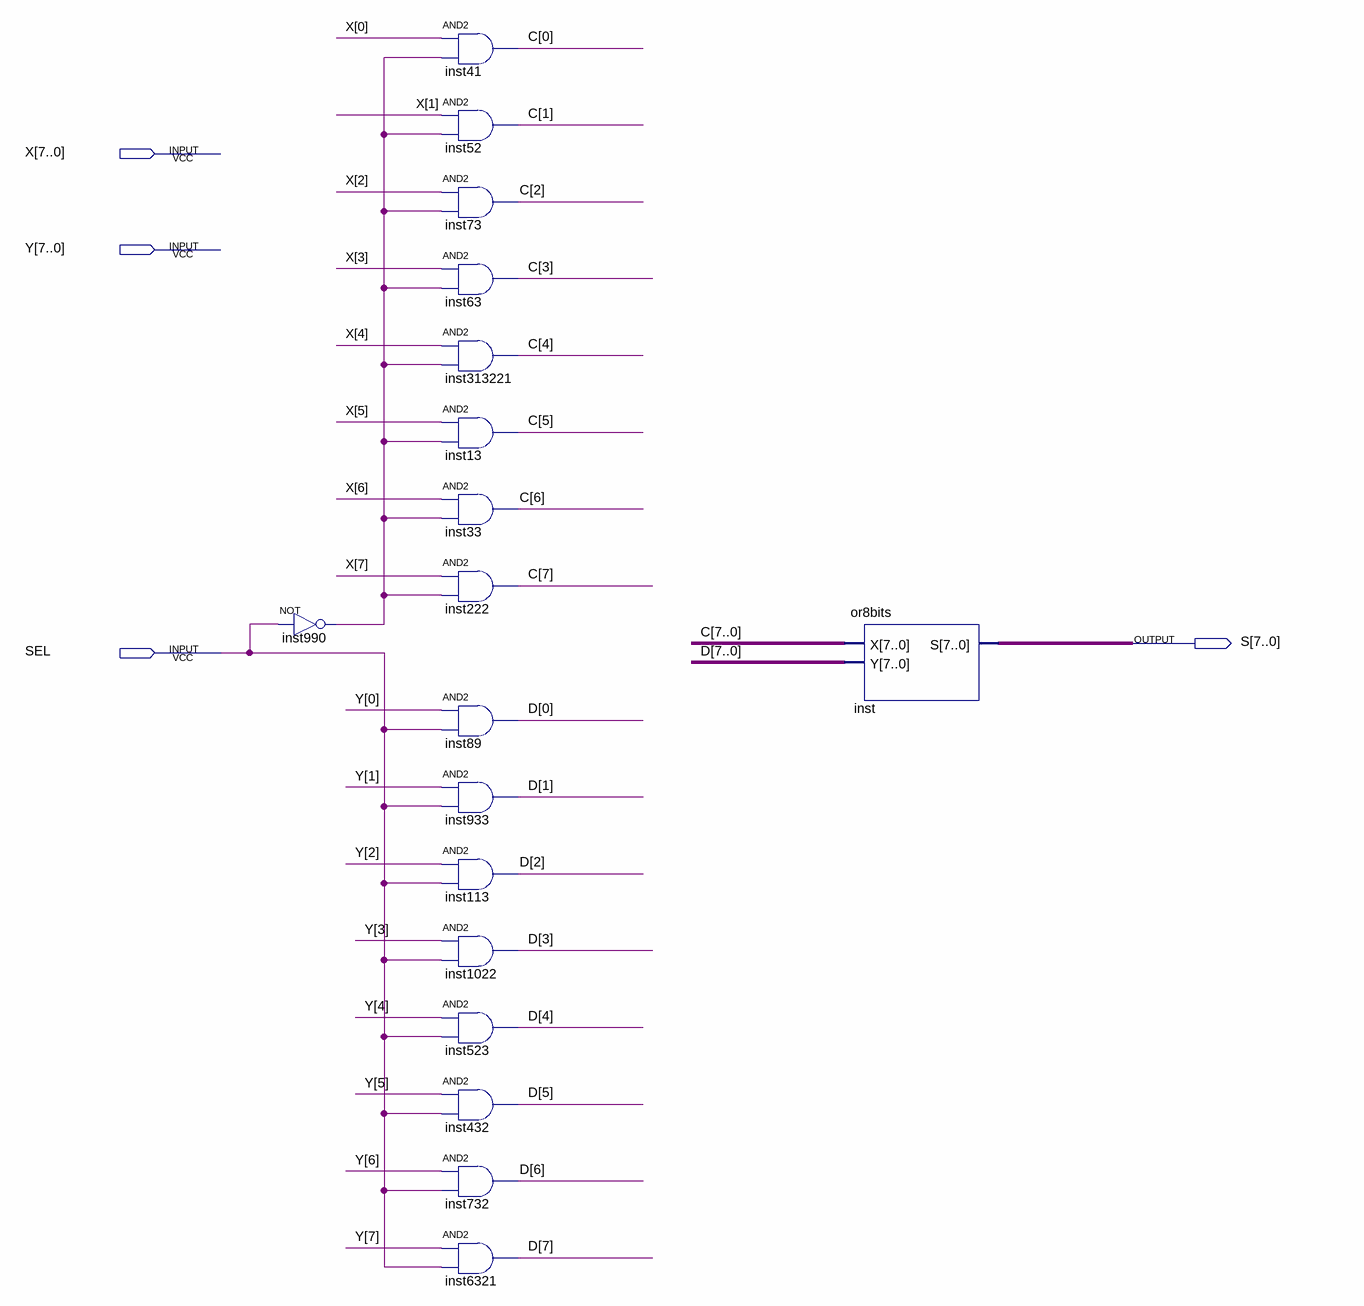
[diagram p0: schematic sheet]
// Quartus schematic multiplexador8bits.bdf as structural Verilog: 18 symbols, 4 pins
module multiplexador8bits (
  input  [7:0] X,
  input  [7:0] Y,
  input  SEL,
  output [7:0] S
);

  wire inst990_out;
  wire [7:0] C, D;

  not inst990 (inst990_out, SEL);
  and inst41 (C[0], X[0], inst990_out);
  and inst52 (C[1], X[1], inst990_out);
  and inst73 (C[2], X[2], inst990_out);
  and inst63 (C[3], X[3], inst990_out);
  and inst313221 (C[4], X[4], inst990_out);
  and inst13 (C[5], X[5], inst990_out);
  and inst33 (C[6], X[6], inst990_out);
  and inst222 (C[7], X[7], inst990_out);
  and inst89 (D[0], Y[0], SEL);
  and inst933 (D[1], Y[1], SEL);
  and inst113 (D[2], Y[2], SEL);
  and inst1022 (D[3], Y[3], SEL);
  and inst523 (D[4], Y[4], SEL);
  and inst432 (D[5], Y[5], SEL);
  and inst732 (D[6], Y[6], SEL);
  and inst6321 (D[7], Y[7], SEL);
  or8bits inst (.X(C), .Y(D), .S(S));
endmodule
